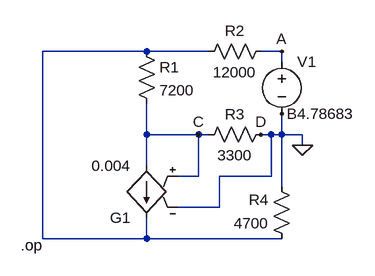
[diagram p0: schematic Q6.asc]
Q6.asc, the LTspice schematic file:
Version 4
SHEET 1 880 680
WIRE 0 -80 -160 -80
WIRE 96 -80 0 -80
WIRE 208 -80 176 -80
WIRE 208 -64 208 -80
WIRE 0 48 0 0
WIRE 80 48 0 48
WIRE 96 48 80 48
WIRE 192 48 176 48
WIRE 208 48 208 16
WIRE 208 48 192 48
WIRE 240 48 208 48
WIRE 240 64 240 48
WIRE 0 96 0 48
WIRE 80 112 80 48
WIRE 80 112 48 112
WIRE 192 112 192 48
WIRE 192 112 112 112
WIRE 208 128 208 48
WIRE 112 160 112 112
WIRE 112 160 48 160
WIRE -160 208 -160 -80
WIRE 0 208 0 176
WIRE 0 208 -160 208
WIRE 208 208 0 208
FLAG 208 -80 A
FLAG 208 16 B
FLAG 240 64 0
FLAG 80 48 C
FLAG 176 48 D
SYMBOL res -16 -96 R0
SYMATTR InstName R1
SYMATTR Value 7200
SYMBOL res 192 -96 R90
WINDOW 0 0 56 VBottom 2
WINDOW 3 32 56 VTop 2
SYMATTR InstName R2
SYMATTR Value 12000
SYMBOL res 192 32 R90
WINDOW 0 0 56 VBottom 2
WINDOW 3 32 56 VTop 2
SYMATTR InstName R3
SYMATTR Value 3300
SYMBOL res 224 224 R180
WINDOW 0 36 76 Left 2
WINDOW 3 36 40 Left 2
SYMATTR InstName R4
SYMATTR Value 4700
SYMBOL voltage 208 -80 R0
WINDOW 123 0 0 Left 2
WINDOW 39 0 0 Left 2
SYMATTR InstName V1
SYMATTR Value 4.78683
SYMBOL g2 0 192 R180
SYMATTR InstName G1
SYMATTR Value 0.004
TEXT -194 218 Left 2 !.op

The netlist it stands for:
* Q6.asc
R1 N001 C 7200
R2 A N001 12000
R3 0 C 3300
R4 N001 0 4700
V1 A 0 4.78683
G1 C N001 C 0 0.004
.op
.backanno
.end